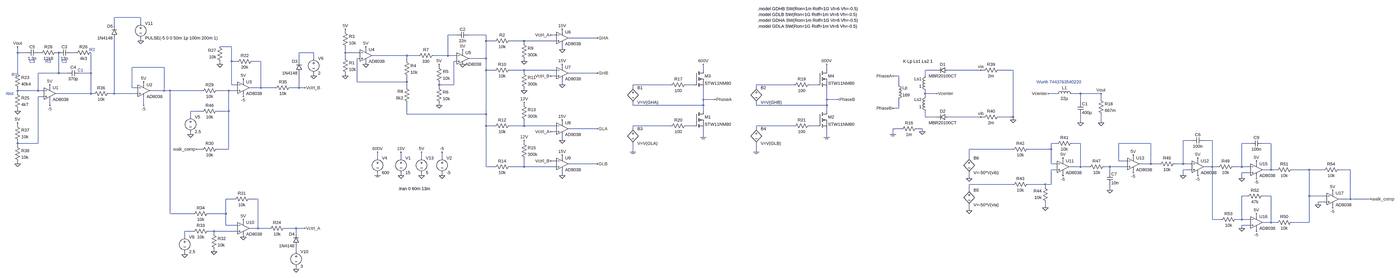
[diagram p0: schematic Full_Bridge_Converter.asc, whole sheet]
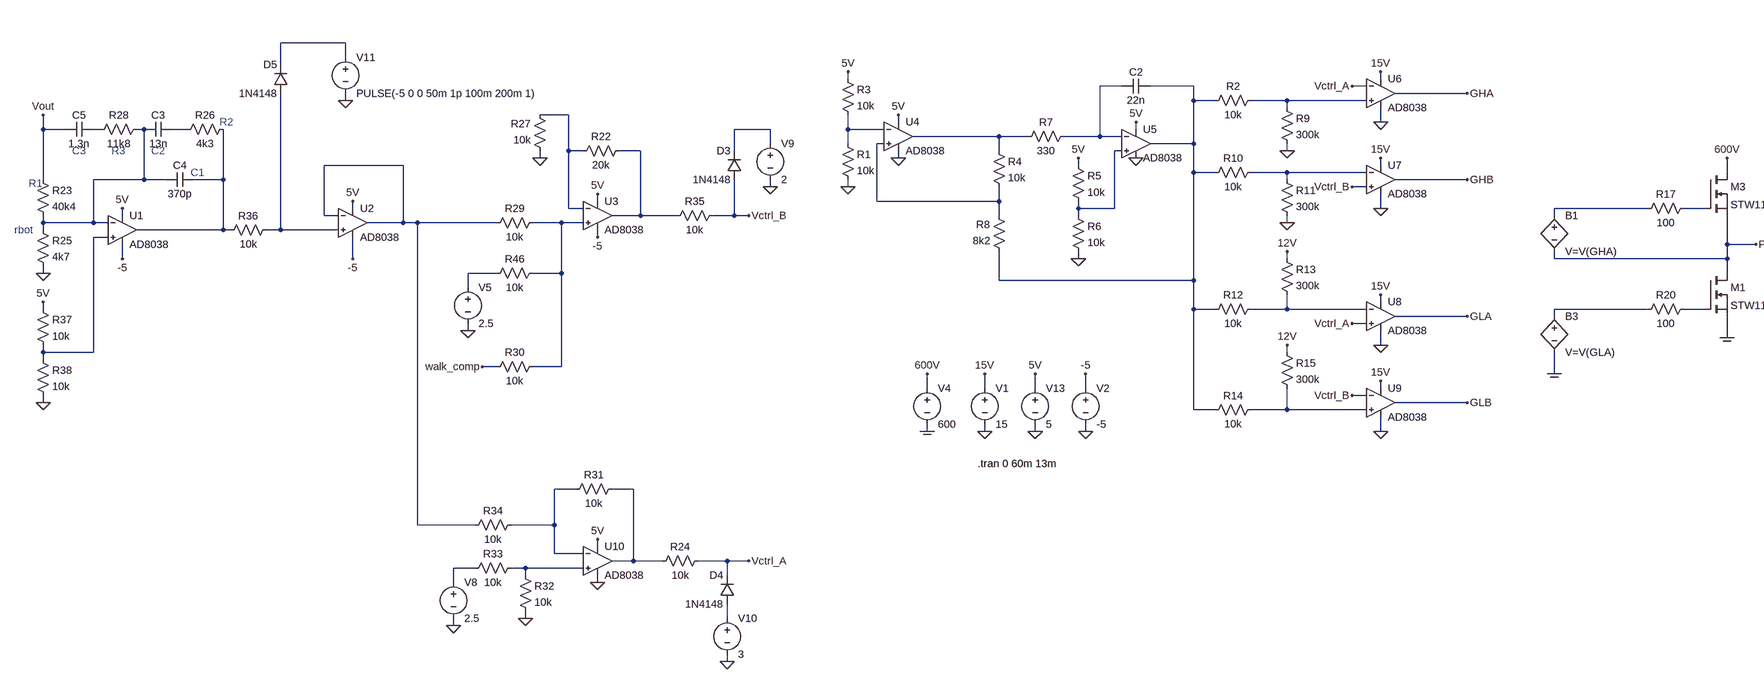
[diagram p1: schematic Full_Bridge_Converter.asc, part, row 1 of 1, column 1 of 2]
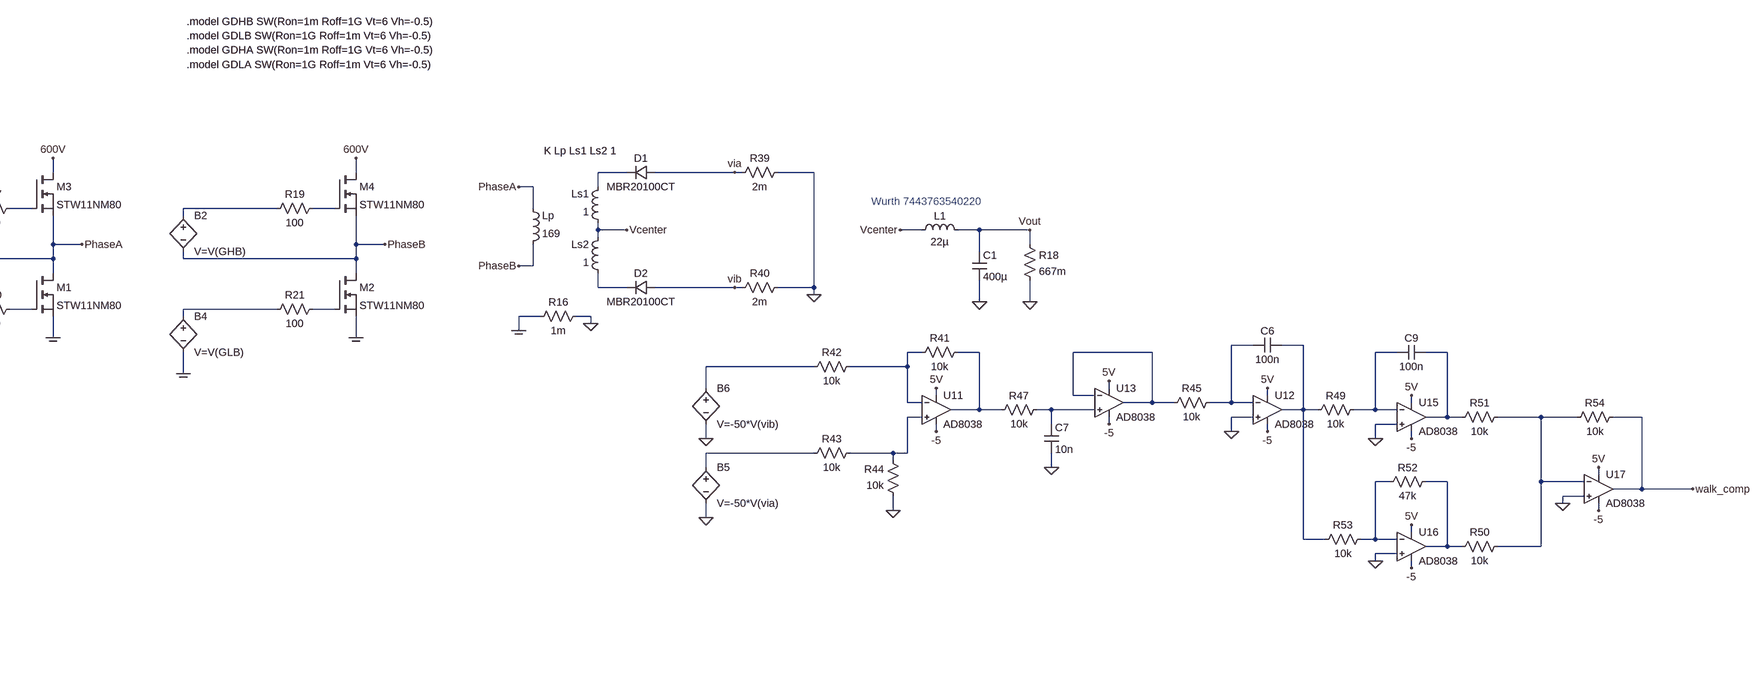
[diagram p2: schematic Full_Bridge_Converter.asc, part, row 1 of 1, column 2 of 2]
Full_Bridge_Converter.asc, the LTspice schematic file:
Version 4.1
SHEET 1 7284 996
WIRE -208 -400 -352 -400
WIRE -208 -368 -208 -400
WIRE -352 -352 -352 -400
WIRE 1072 -320 1072 -336
WIRE 2256 -320 2256 -336
WIRE 1680 -304 1632 -304
WIRE 1840 -304 1744 -304
WIRE 2224 -304 2192 -304
WIRE 2448 -288 2288 -288
WIRE -208 -272 -208 -288
WIRE 1840 -272 1840 -304
WIRE 1888 -272 1840 -272
WIRE 2048 -272 1968 -272
WIRE 2224 -272 2048 -272
WIRE 2048 -256 2048 -272
WIRE 288 -240 224 -240
WIRE 1184 -224 1184 -240
WIRE 2256 -224 2256 -256
WIRE -880 -208 -880 -240
WIRE -832 -208 -880 -208
WIRE -752 -208 -768 -208
WIRE -656 -208 -672 -208
WIRE -560 -208 -592 -208
WIRE 736 -208 656 -208
WIRE 1072 -208 1072 -240
WIRE 1152 -208 1072 -208
WIRE 1712 -208 1712 -224
WIRE 1408 -192 1216 -192
WIRE 1472 -192 1408 -192
WIRE 1632 -192 1632 -304
WIRE 1632 -192 1552 -192
WIRE 1680 -192 1632 -192
WIRE 736 -176 736 -208
WIRE 1072 -176 1072 -208
WIRE 1152 -176 1136 -176
WIRE 1840 -176 1840 -272
WIRE 1840 -176 1744 -176
WIRE 288 -160 288 -240
WIRE 320 -160 288 -160
WIRE 448 -160 400 -160
WIRE 656 -160 656 -208
WIRE 1408 -160 1408 -192
WIRE 1680 -160 1664 -160
WIRE 2048 -160 2048 -176
WIRE 224 -144 224 -160
WIRE 1184 -144 1184 -160
WIRE -80 -128 -256 -128
WIRE 1584 -128 1584 -144
WIRE 2256 -128 2256 -144
WIRE 1840 -112 1840 -176
WIRE 1888 -112 1840 -112
WIRE 2048 -112 1968 -112
WIRE 2224 -112 2048 -112
WIRE 3184 -112 3184 -144
WIRE 3984 -112 3984 -144
WIRE 4704 -112 4640 -112
WIRE 4944 -112 4768 -112
WIRE 4960 -112 4944 -112
WIRE 5120 -112 5040 -112
WIRE -880 -96 -880 -208
WIRE -656 -96 -656 -208
WIRE -656 -96 -768 -96
WIRE -608 -96 -656 -96
WIRE -480 -96 -480 -208
WIRE -480 -96 -544 -96
WIRE 2048 -96 2048 -112
WIRE 2448 -96 2288 -96
WIRE 736 -80 736 -96
WIRE 1072 -80 1072 -96
WIRE 2224 -80 2192 -80
WIRE 4496 -80 4464 -80
WIRE 4640 -80 4640 -112
WIRE 352 -48 352 -64
WIRE 1136 -48 1136 -176
WIRE 1408 -48 1408 -80
WIRE 1408 -48 1136 -48
WIRE -192 -32 -192 -48
WIRE 288 -32 288 -160
WIRE 320 -32 288 -32
WIRE 1584 -32 1584 -48
WIRE 1664 -32 1664 -160
WIRE 1664 -32 1584 -32
WIRE 2256 -32 2256 -64
WIRE 3008 -32 2800 -32
WIRE 3136 -32 3088 -32
WIRE 3808 -32 3600 -32
WIRE 3936 -32 3888 -32
WIRE 4496 -32 4496 -80
WIRE -704 -16 -704 -32
WIRE -256 -16 -256 -128
WIRE -224 -16 -256 -16
WIRE 448 -16 448 -160
WIRE 448 -16 384 -16
WIRE 528 -16 448 -16
WIRE 656 -16 656 -96
WIRE 656 -16 608 -16
WIRE 688 -16 656 -16
WIRE 1408 -16 1408 -48
WIRE 1584 -16 1584 -32
WIRE 2800 -16 2800 -32
WIRE 3600 -16 3600 -32
WIRE -880 0 -880 -16
WIRE -768 0 -768 -96
WIRE -768 0 -880 0
WIRE -736 0 -768 0
WIRE -80 0 -80 -128
WIRE -80 0 -160 0
WIRE -48 0 -80 0
WIRE 128 0 -48 0
WIRE 272 0 208 0
WIRE 320 0 272 0
WIRE 2048 0 2048 -16
WIRE -880 16 -880 0
WIRE -480 16 -480 -96
WIRE -480 16 -672 16
WIRE -464 16 -480 16
WIRE -352 16 -352 -288
WIRE -352 16 -384 16
WIRE -224 16 -352 16
WIRE 4640 16 4640 0
WIRE 4704 16 4640 16
WIRE 5360 16 5312 16
WIRE 5488 16 5440 16
WIRE 5600 16 5488 16
WIRE -736 32 -768 32
WIRE 352 32 352 16
WIRE 4640 32 4640 16
WIRE 3184 48 3184 -16
WIRE 3248 48 3184 48
WIRE 3984 48 3984 -16
WIRE 4048 48 3984 48
WIRE 5600 48 5600 16
WIRE 5488 64 5488 16
WIRE -704 80 -704 48
WIRE -192 80 -192 32
WIRE 1584 80 1584 64
WIRE 2048 80 2048 64
WIRE 2800 80 2800 64
WIRE 3184 80 3184 48
WIRE 3184 80 2800 80
WIRE 3600 80 3600 64
WIRE 3984 80 3984 48
WIRE 3984 80 3600 80
WIRE 4496 96 4496 48
WIRE 4496 96 4464 96
WIRE -880 112 -880 96
WIRE 128 112 64 112
WIRE 272 112 272 0
WIRE 272 112 208 112
WIRE 3184 112 3184 80
WIRE 3984 112 3984 80
WIRE 1408 128 1408 64
WIRE 1840 128 1840 -112
WIRE 1840 128 1408 128
WIRE 64 144 64 112
WIRE 4640 144 4640 112
WIRE 4704 144 4640 144
WIRE 4944 144 4768 144
WIRE 4960 144 4944 144
WIRE 5120 144 5120 -112
WIRE 5120 144 5040 144
WIRE 5120 160 5120 144
WIRE 2256 176 2256 160
WIRE 5488 176 5488 128
WIRE 5600 176 5600 128
WIRE -880 192 -880 176
WIRE 1840 192 1840 128
WIRE 1888 192 1840 192
WIRE 2048 192 2048 160
WIRE 2048 192 1968 192
WIRE 2224 192 2048 192
WIRE 3008 192 2800 192
WIRE 3136 192 3088 192
WIRE 3808 192 3600 192
WIRE 3936 192 3888 192
WIRE 2448 208 2288 208
WIRE 2800 208 2800 192
WIRE 3600 208 3600 192
WIRE 4512 208 4464 208
WIRE 4624 208 4592 208
WIRE 2224 224 2192 224
WIRE 4624 224 4624 208
WIRE 64 240 64 224
WIRE 4464 240 4464 208
WIRE 3184 256 3184 208
WIRE 3984 256 3984 208
WIRE 2256 272 2256 240
WIRE 6096 272 6048 272
WIRE 6208 272 6160 272
WIRE -880 288 -880 272
WIRE -768 288 -768 32
WIRE -768 288 -880 288
WIRE 2048 288 2048 272
WIRE 5360 288 5328 288
WIRE 5488 288 5440 288
WIRE 5872 288 5696 288
WIRE 6416 288 6368 288
WIRE 6528 288 6480 288
WIRE -880 304 -880 288
WIRE 128 320 96 320
WIRE 272 320 272 112
WIRE 272 320 208 320
WIRE 5120 320 4880 320
WIRE 5328 320 5328 288
WIRE 5328 320 5200 320
WIRE 2800 336 2800 288
WIRE 3600 336 3600 288
WIRE 1248 368 1248 336
WIRE 1376 368 1376 336
WIRE 1488 368 1488 336
WIRE 1600 368 1600 336
WIRE 2256 368 2256 352
WIRE 4880 368 4880 320
WIRE 5776 368 5776 352
WIRE 2224 384 2192 384
WIRE 5392 384 5392 368
WIRE 5696 384 5696 288
WIRE 5744 384 5696 384
WIRE 6128 384 6128 368
WIRE -880 400 -880 384
WIRE 2448 400 2288 400
WIRE 5328 400 5328 320
WIRE 5360 400 5328 400
WIRE 5872 400 5872 288
WIRE 5872 400 5808 400
WIRE 5920 400 5872 400
WIRE 6048 400 6048 272
WIRE 6048 400 6000 400
WIRE 6096 400 6048 400
WIRE 6448 400 6448 384
WIRE 1840 416 1840 192
WIRE 1888 416 1840 416
WIRE 2048 416 2048 368
WIRE 2048 416 1968 416
WIRE 2224 416 2048 416
WIRE 5488 416 5488 288
WIRE 5488 416 5424 416
WIRE 5536 416 5488 416
WIRE 5648 416 5616 416
WIRE 5744 416 5648 416
WIRE 6208 416 6208 272
WIRE 6208 416 6160 416
WIRE 6240 416 6208 416
WIRE 6368 416 6368 288
WIRE 6368 416 6320 416
WIRE 6416 416 6368 416
WIRE 5360 432 5328 432
WIRE 6096 432 6048 432
WIRE 6528 432 6528 288
WIRE 6528 432 6480 432
WIRE 6560 432 6528 432
WIRE 6736 432 6640 432
WIRE 6816 432 6736 432
WIRE 6960 432 6896 432
WIRE 5648 448 5648 416
WIRE 5776 448 5776 432
WIRE 6416 448 6368 448
WIRE 1248 464 1248 448
WIRE 1376 464 1376 448
WIRE 1488 464 1488 448
WIRE 1600 464 1600 448
WIRE 2256 464 2256 432
WIRE 5392 464 5392 448
WIRE 6048 464 6048 432
WIRE 6128 464 6128 448
WIRE 4880 480 4880 448
WIRE 6368 480 6368 448
WIRE 6448 480 6448 464
WIRE 5120 512 4880 512
WIRE 5296 512 5200 512
WIRE 5328 512 5328 432
WIRE 5328 512 5296 512
WIRE 5296 528 5296 512
WIRE 4880 544 4880 512
WIRE 5648 544 5648 512
WIRE 6864 560 6864 544
WIRE 6400 576 6368 576
WIRE 6528 576 6480 576
WIRE 6736 576 6736 432
WIRE 6832 576 6736 576
WIRE 304 592 256 592
WIRE 432 592 384 592
WIRE 6960 592 6960 432
WIRE 6960 592 6896 592
WIRE 7088 592 6960 592
WIRE 6832 608 6784 608
WIRE 6784 624 6784 608
WIRE 5296 640 5296 608
WIRE 6864 640 6864 624
WIRE 4880 656 4880 624
WIRE -48 672 -48 0
WIRE 80 672 -48 672
WIRE 256 672 256 592
WIRE 256 672 160 672
WIRE 6448 688 6448 672
WIRE 6208 704 6208 416
WIRE 6256 704 6208 704
WIRE 6368 704 6368 576
WIRE 6368 704 6336 704
WIRE 6416 704 6368 704
WIRE 352 720 352 704
WIRE 6528 720 6528 576
WIRE 6528 720 6480 720
WIRE 6560 720 6528 720
WIRE 6736 720 6736 576
WIRE 6736 720 6640 720
WIRE 256 736 256 672
WIRE 320 736 256 736
WIRE 6416 736 6368 736
WIRE 432 752 432 592
WIRE 432 752 384 752
WIRE 496 752 432 752
WIRE 640 752 576 752
WIRE 688 752 640 752
WIRE 6368 752 6368 736
WIRE 80 768 32 768
WIRE 192 768 160 768
WIRE 320 768 192 768
WIRE 6448 768 6448 752
WIRE 192 784 192 768
WIRE 640 784 640 752
WIRE 32 800 32 768
WIRE 352 800 352 784
WIRE 192 880 192 864
WIRE 640 880 640 848
WIRE 32 896 32 880
WIRE 640 976 640 960
FLAG 1376 464 0
FLAG 1376 336 15V
FLAG 1184 -144 0
FLAG 1072 -80 0
FLAG 1584 80 0
FLAG 1712 -144 0
FLAG 2256 -224 0
FLAG 2256 -32 0
FLAG 2192 -304 Vctrl_A
FLAG 2192 -80 Vctrl_B
FLAG 2448 -288 GHA
FLAG 2448 -96 GHB
FLAG 2256 272 0
FLAG 2256 464 0
FLAG 2192 224 Vctrl_A
FLAG 2192 384 Vctrl_B
FLAG 2448 208 GLA
FLAG 2448 400 GLB
FLAG 2048 -160 0
FLAG 2048 0 0
FLAG 2048 64 12V
FLAG 2048 272 12V
FLAG 1248 336 600V
FLAG 3184 -144 600V
FLAG 3984 -144 600V
FLAG 4048 48 PhaseB
FLAG 3248 48 PhaseA
FLAG 4464 96 PhaseB
FLAG 4464 -80 PhaseA
FLAG -880 112 0
FLAG 5600 16 Vout
FLAG -880 -240 Vout
FLAG 4624 224 0
FLAG 5488 176 0
FLAG 5600 176 0
FLAG 4464 240 COM
FLAG 3984 256 COM
FLAG 3600 336 COM
FLAG 3184 256 COM
FLAG 2800 336 COM
FLAG 1248 464 COM
FLAG 224 -144 0
FLAG 64 240 0
FLAG 352 800 0
FLAG 192 880 0
FLAG 32 896 0
FLAG 688 -16 Vctrl_B
FLAG 688 752 Vctrl_A
FLAG 640 976 0
FLAG 736 -80 0
FLAG -208 -272 0
FLAG 1488 464 0
FLAG 1488 336 5V
FLAG 1072 -336 5V
FLAG 1184 -240 5V
FLAG 1584 -144 5V
FLAG 1712 -224 5V
FLAG 1600 464 0
FLAG 1600 336 -5
FLAG -192 -48 5V
FLAG -704 80 -5
FLAG -192 80 -5
FLAG -704 -32 5V
FLAG -880 400 0
FLAG -880 176 5V
FLAG 352 -64 5V
FLAG 352 704 5V
FLAG 2256 -336 15V
FLAG 2256 -144 15V
FLAG 2256 160 15V
FLAG 2256 352 15V
FLAG 5120 160 0
FLAG 5312 16 Vcenter
FLAG 4704 16 Vcenter
FLAG 4880 656 0
FLAG 4880 480 0
FLAG 4944 -112 via
FLAG 4944 144 vib
FLAG 5392 368 5V
FLAG 5392 464 -5
FLAG 5296 640 0
FLAG 96 320 walk_comp
FLAG 352 32 -5
FLAG 6128 368 5V
FLAG 6128 464 -5
FLAG 6048 464 0
FLAG 5648 544 0
FLAG 5776 352 5V
FLAG 5776 448 -5
FLAG 6448 384 5V
FLAG 6448 480 -5
FLAG 6368 480 0
FLAG 7088 592 walk_comp
FLAG 6448 672 5V
FLAG 6448 768 -5
FLAG 6864 544 5V
FLAG 6864 640 -5
FLAG 6784 624 0
FLAG 6368 752 0
SYMBOL voltage 1376 352 R0
WINDOW 123 0 0 Left 0
WINDOW 39 0 0 Left 0
SYMATTR InstName V1
SYMATTR Value 15
SYMBOL res 1056 -192 R0
SYMATTR InstName R1
SYMATTR Value 10k
SYMBOL res 1056 -336 R0
SYMATTR InstName R3
SYMATTR Value 10k
SYMBOL res 1392 -176 R0
SYMATTR InstName R4
SYMATTR Value 10k
SYMBOL OpAmps\\AD8038 1184 -256 R0
SYMATTR InstName U4
SYMBOL OpAmps\\AD8038 1712 -240 R0
SYMATTR InstName U5
SYMBOL res 1568 -144 R0
SYMATTR InstName R5
SYMATTR Value 10k
SYMBOL res 1568 -32 R0
SYMATTR InstName R6
SYMATTR Value 10k
SYMBOL res 1568 -208 R90
WINDOW 0 0 56 VBottom 2
WINDOW 3 32 56 VTop 2
SYMATTR InstName R7
SYMATTR Value 330
SYMBOL res 1424 80 R180
WINDOW 0 36 76 Left 2
WINDOW 3 36 40 Left 2
SYMATTR InstName R8
SYMATTR Value 8k2
SYMBOL cap 1744 -320 R90
WINDOW 0 0 32 VBottom 2
WINDOW 3 32 32 VTop 2
SYMATTR InstName C2
SYMATTR Value 22n
SYMBOL OpAmps\\AD8038 2256 -352 R0
SYMATTR InstName U6
SYMBOL OpAmps\\AD8038 2256 -160 R0
SYMATTR InstName U7
SYMBOL OpAmps\\AD8038 2256 144 R0
SYMATTR InstName U8
SYMBOL OpAmps\\AD8038 2256 336 R0
SYMATTR InstName U9
SYMBOL res 1984 -288 R90
WINDOW 0 0 56 VBottom 2
WINDOW 3 32 56 VTop 2
SYMATTR InstName R2
SYMATTR Value 10k
SYMBOL res 2032 -272 R0
SYMATTR InstName R9
SYMATTR Value 300k
SYMBOL res 1984 -128 R90
WINDOW 0 0 56 VBottom 2
WINDOW 3 32 56 VTop 2
SYMATTR InstName R10
SYMATTR Value 10k
SYMBOL res 2032 -112 R0
SYMATTR InstName R11
SYMATTR Value 300k
SYMBOL res 1984 176 R90
WINDOW 0 0 56 VBottom 2
WINDOW 3 32 56 VTop 2
SYMATTR InstName R12
SYMATTR Value 10k
SYMBOL res 1984 400 R90
WINDOW 0 0 56 VBottom 2
WINDOW 3 32 56 VTop 2
SYMATTR InstName R14
SYMATTR Value 10k
SYMBOL res 2032 64 R0
SYMATTR InstName R13
SYMATTR Value 300k
SYMBOL res 2032 272 R0
SYMATTR InstName R15
SYMATTR Value 300k
SYMBOL nmos 3136 112 R0
SYMATTR InstName M1
SYMATTR Value STW11NM80
SYMBOL voltage 1248 352 R0
WINDOW 123 0 0 Left 0
WINDOW 39 0 0 Left 0
SYMATTR InstName V4
SYMATTR Value 600
SYMBOL res 3104 -48 R90
WINDOW 0 0 56 VBottom 2
WINDOW 3 32 56 VTop 2
SYMATTR InstName R17
SYMATTR Value 100
SYMBOL res 3904 -48 R90
WINDOW 0 0 56 VBottom 2
WINDOW 3 32 56 VTop 2
SYMATTR InstName R19
SYMATTR Value 100
SYMBOL nmos 3936 112 R0
SYMATTR InstName M2
SYMATTR Value STW11NM80
SYMBOL nmos 3136 -112 R0
SYMATTR InstName M3
SYMATTR Value STW11NM80
SYMBOL nmos 3936 -112 R0
SYMATTR InstName M4
SYMATTR Value STW11NM80
SYMBOL bv 2800 -32 R0
SYMATTR InstName B1
SYMATTR Value V=V(GHA)
SYMBOL bv 3600 -32 R0
SYMATTR InstName B2
SYMATTR Value V=V(GHB)
SYMBOL ind 4480 64 M180
WINDOW 0 36 80 Left 2
WINDOW 3 36 40 Left 2
SYMATTR InstName Lp
SYMATTR Value 169
SYMATTR SpiceLine Rser=10m
SYMBOL ind 4656 16 R180
WINDOW 0 36 80 Left 2
WINDOW 3 36 40 Left 2
SYMATTR InstName Ls1
SYMATTR Value 1
SYMATTR SpiceLine Rser=10m
SYMBOL ind 4656 128 R180
WINDOW 0 36 80 Left 2
WINDOW 3 36 40 Left 2
SYMATTR InstName Ls2
SYMATTR Value 1
SYMATTR SpiceLine Rser=10m
SYMBOL res 4608 192 R90
WINDOW 0 0 56 VBottom 2
WINDOW 3 32 56 VTop 2
SYMATTR InstName R16
SYMATTR Value 1m
SYMBOL bv 2800 192 R0
SYMATTR InstName B3
SYMATTR Value V=V(GLA)
SYMBOL bv 3600 192 R0
SYMATTR InstName B4
SYMATTR Value V=V(GLB)
SYMBOL ind 5344 32 R270
WINDOW 0 32 56 VTop 2
WINDOW 3 5 56 VBottom 2
SYMATTR InstName L1
SYMATTR Value 22µ
SYMBOL cap 5472 64 R0
SYMATTR InstName C1
SYMATTR Value 400µ
SYMBOL res 5584 32 R0
SYMATTR InstName R18
SYMATTR Value 667m
SYMBOL diode 4768 -96 M270
WINDOW 0 32 32 VTop 2
WINDOW 3 0 32 VBottom 2
SYMATTR InstName D1
SYMATTR Value MBR20100CT
SYMBOL diode 4768 160 M270
WINDOW 0 32 32 VTop 2
WINDOW 3 0 32 VBottom 2
SYMATTR InstName D2
SYMATTR Value MBR20100CT
SYMBOL res 3104 176 R90
WINDOW 0 0 56 VBottom 2
WINDOW 3 32 56 VTop 2
SYMATTR InstName R20
SYMATTR Value 100
SYMBOL res 3904 176 R90
WINDOW 0 0 56 VBottom 2
WINDOW 3 32 56 VTop 2
SYMATTR InstName R21
SYMATTR Value 100
SYMBOL res -896 -112 R0
SYMATTR InstName R23
SYMATTR Value 40k4
SYMBOL res -896 0 R0
SYMATTR InstName R25
SYMATTR Value 4k7
SYMBOL cap -592 -224 R90
WINDOW 0 0 32 VBottom 2
WINDOW 3 32 32 VTop 2
SYMATTR InstName C3
SYMATTR Value 13n
SYMBOL cap -544 -112 R90
WINDOW 0 0 32 VBottom 2
WINDOW 3 32 32 VTop 2
SYMATTR InstName C4
SYMATTR Value 370p
SYMBOL res -464 -224 R90
WINDOW 0 0 56 VBottom 2
WINDOW 3 32 56 VTop 2
SYMATTR InstName R26
SYMATTR Value 4k3
SYMBOL OpAmps\\AD8038 -704 -48 R0
SYMATTR InstName U1
SYMBOL OpAmps\\AD8038 352 -80 R0
SYMATTR InstName U3
SYMBOL res 416 -176 R90
WINDOW 0 0 56 VBottom 2
WINDOW 3 32 56 VTop 2
SYMATTR InstName R22
SYMATTR Value 20k
SYMBOL res 240 -144 R180
WINDOW 0 36 76 Left 2
WINDOW 3 36 40 Left 2
SYMATTR InstName R27
SYMATTR Value 10k
SYMBOL res 224 -16 R90
WINDOW 0 0 56 VBottom 2
WINDOW 3 32 56 VTop 2
SYMATTR InstName R29
SYMATTR Value 10k
SYMBOL res 224 304 R90
WINDOW 0 0 56 VBottom 2
WINDOW 3 32 56 VTop 2
SYMATTR InstName R30
SYMATTR Value 10k
SYMBOL voltage 64 128 R0
WINDOW 123 0 0 Left 0
WINDOW 39 0 0 Left 0
SYMATTR InstName V5
SYMATTR Value 2.5
SYMBOL OpAmps\\AD8038 352 688 R0
SYMATTR InstName U10
SYMBOL res 400 576 R90
WINDOW 0 0 56 VBottom 2
WINDOW 3 32 56 VTop 2
SYMATTR InstName R31
SYMATTR Value 10k
SYMBOL res 176 768 R0
SYMATTR InstName R32
SYMATTR Value 10k
SYMBOL res 176 752 R90
WINDOW 0 0 56 VBottom 2
WINDOW 3 32 56 VTop 2
SYMATTR InstName R33
SYMATTR Value 10k
SYMBOL res 176 656 R90
WINDOW 0 0 56 VBottom 2
WINDOW 3 32 56 VTop 2
SYMATTR InstName R34
SYMATTR Value 10k
SYMBOL voltage 32 784 R0
WINDOW 123 0 0 Left 0
WINDOW 39 0 0 Left 0
SYMATTR InstName V8
SYMATTR Value 2.5
SYMBOL diode 656 848 R180
WINDOW 0 24 64 Left 2
WINDOW 3 24 0 Left 2
SYMATTR InstName D4
SYMATTR Value 1N4148
SYMBOL voltage 640 864 R0
WINDOW 123 0 0 Left 0
WINDOW 39 0 0 Left 0
SYMATTR InstName V10
SYMATTR Value 3
SYMBOL res 592 736 R90
WINDOW 0 0 56 VBottom 2
WINDOW 3 32 56 VTop 2
SYMATTR InstName R24
SYMATTR Value 10k
SYMBOL res 624 -32 R90
WINDOW 0 0 56 VBottom 2
WINDOW 3 32 56 VTop 2
SYMATTR InstName R35
SYMATTR Value 10k
SYMBOL diode 672 -96 R180
WINDOW 0 24 64 Left 2
WINDOW 3 24 0 Left 2
SYMATTR InstName D3
SYMATTR Value 1N4148
SYMBOL voltage 736 -192 R0
WINDOW 123 0 0 Left 0
WINDOW 39 0 0 Left 0
SYMATTR InstName V9
SYMATTR Value 2
SYMBOL diode -336 -288 R180
WINDOW 0 24 64 Left 2
WINDOW 3 24 0 Left 2
SYMATTR InstName D5
SYMATTR Value 1N4148
SYMBOL voltage -208 -384 R0
WINDOW 123 0 0 Left 0
WINDOW 39 0 0 Left 0
SYMATTR InstName V11
SYMATTR Value PULSE(-5 0 0 50m 1p 100m 200m 1)
SYMBOL res -368 0 R90
WINDOW 0 0 56 VBottom 2
WINDOW 3 32 56 VTop 2
SYMATTR InstName R36
SYMATTR Value 10k
SYMBOL OpAmps\\AD8038 -192 -64 R0
SYMATTR InstName U2
SYMBOL res -656 -224 R90
WINDOW 0 0 56 VBottom 2
WINDOW 3 32 56 VTop 2
SYMATTR InstName R28
SYMATTR Value 11k8
SYMBOL cap -768 -224 R90
WINDOW 0 0 32 VBottom 2
WINDOW 3 32 32 VTop 2
SYMATTR InstName C5
SYMATTR Value 1.3n
SYMBOL voltage 1488 352 R0
WINDOW 123 0 0 Left 0
WINDOW 39 0 0 Left 0
SYMATTR InstName V13
SYMATTR Value 5
SYMBOL voltage 1600 352 R0
WINDOW 123 0 0 Left 0
WINDOW 39 0 0 Left 0
SYMATTR InstName V2
SYMATTR Value -5
SYMBOL res -896 176 R0
SYMATTR InstName R37
SYMATTR Value 10k
SYMBOL res -896 288 R0
SYMATTR InstName R38
SYMATTR Value 10k
SYMBOL res 5056 -128 R90
WINDOW 0 0 56 VBottom 2
WINDOW 3 32 56 VTop 2
SYMATTR InstName R39
SYMATTR Value 2m
SYMBOL res 5056 128 R90
WINDOW 0 0 56 VBottom 2
WINDOW 3 32 56 VTop 2
SYMATTR InstName R40
SYMATTR Value 2m
SYMBOL bv 4880 528 R0
SYMATTR InstName B5
SYMATTR Value V=-50*V(via)
SYMBOL bv 4880 352 R0
SYMATTR InstName B6
SYMATTR Value V=-50*V(vib)
SYMBOL OpAmps\\AD8038 5392 352 R0
SYMATTR InstName U11
SYMBOL res 5456 272 R90
WINDOW 0 0 56 VBottom 2
WINDOW 3 32 56 VTop 2
SYMATTR InstName R41
SYMATTR Value 10k
SYMBOL res 5216 304 R90
WINDOW 0 0 56 VBottom 2
WINDOW 3 32 56 VTop 2
SYMATTR InstName R42
SYMATTR Value 10k
SYMBOL res 5216 496 R90
WINDOW 0 0 56 VBottom 2
WINDOW 3 32 56 VTop 2
SYMATTR InstName R43
SYMATTR Value 10k
SYMBOL res 5312 624 R180
WINDOW 0 36 76 Left 2
WINDOW 3 36 40 Left 2
SYMATTR InstName R44
SYMATTR Value 10k
SYMBOL res 224 96 R90
WINDOW 0 0 56 VBottom 2
WINDOW 3 32 56 VTop 2
SYMATTR InstName R46
SYMATTR Value 10k
SYMBOL OpAmps\\AD8038 6128 352 R0
SYMATTR InstName U12
SYMBOL cap 6160 256 R90
WINDOW 0 0 32 VBottom 2
WINDOW 3 32 32 VTop 2
SYMATTR InstName C6
SYMATTR Value 100n
SYMBOL res 6016 384 R90
WINDOW 0 0 56 VBottom 2
WINDOW 3 32 56 VTop 2
SYMATTR InstName R45
SYMATTR Value 10k
SYMBOL res 5632 400 R90
WINDOW 0 0 56 VBottom 2
WINDOW 3 32 56 VTop 2
SYMATTR InstName R47
SYMATTR Value 10k
SYMBOL cap 5632 448 R0
SYMATTR InstName C7
SYMATTR Value 10n
SYMBOL OpAmps\\AD8038 5776 336 R0
SYMATTR InstName U13
SYMBOL OpAmps\\AD8038 6448 368 R0
SYMATTR InstName U15
SYMBOL cap 6480 272 R90
WINDOW 0 0 32 VBottom 2
WINDOW 3 32 32 VTop 2
SYMATTR InstName C9
SYMATTR Value 100n
SYMBOL res 6336 400 R90
WINDOW 0 0 56 VBottom 2
WINDOW 3 32 56 VTop 2
SYMATTR InstName R49
SYMATTR Value 10k
SYMBOL OpAmps\\AD8038 6448 656 R0
SYMATTR InstName U16
SYMBOL res 6656 704 R90
WINDOW 0 0 56 VBottom 2
WINDOW 3 32 56 VTop 2
SYMATTR InstName R50
SYMATTR Value 10k
SYMBOL res 6656 416 R90
WINDOW 0 0 56 VBottom 2
WINDOW 3 32 56 VTop 2
SYMATTR InstName R51
SYMATTR Value 10k
SYMBOL res 6496 560 R90
WINDOW 0 0 56 VBottom 2
WINDOW 3 32 56 VTop 2
SYMATTR InstName R52
SYMATTR Value 47k
SYMBOL res 6352 688 R90
WINDOW 0 0 56 VBottom 2
WINDOW 3 32 56 VTop 2
SYMATTR InstName R53
SYMATTR Value 10k
SYMBOL OpAmps\\AD8038 6864 528 R0
SYMATTR InstName U17
SYMBOL res 6912 416 R90
WINDOW 0 0 56 VBottom 2
WINDOW 3 32 56 VTop 2
SYMATTR InstName R54
SYMATTR Value 10k
TEXT 1360 536 Left 2 !.tran 0 60m 13m
TEXT 3608 -384 Left 2 !.model GDHA SW(Ron=1m Roff=1G Vt=6 Vh=-0.5)
TEXT 3608 -352 Left 2 !.model GDLA SW(Ron=1G Roff=1m Vt=6 Vh=-0.5)
TEXT 3608 -448 Left 2 !.model GDHB SW(Ron=1m Roff=1G Vt=6 Vh=-0.5)
TEXT 3608 -416 Left 2 !.model GDLB SW(Ron=1G Roff=1m Vt=6 Vh=-0.5)
TEXT 4520 -160 Left 2 !K Lp Ls1 Ls2 1
TEXT -552 -112 Left 2 ;C1
TEXT -640 -160 Left 2 ;C2
TEXT -728 -160 Left 2 ;R3
TEXT -816 -160 Left 2 ;C3
TEXT -488 -224 Left 2 ;R2
TEXT -912 -88 Left 2 ;R1
TEXT -944 16 Left 2 ;rbot
TEXT 5248 -48 Left 2 ;Wurth 7443763540220

The netlist it stands for:
* Full_Bridge_Converter.asc
V1 15V 0 15
R1 N010 0 10k
R3 5V N010 10k
R4 N011 N012 10k
X§U4 N012 N010 5V 0 N011 AD8038  ; pins In+ In- V+ V- OUT
X§U5 N014 N002 5V 0 N003 AD8038  ; pins In+ In- V+ V- OUT
R5 5V N014 10k
R6 N014 0 10k
R7 N002 N011 330
R8 N003 N012 8k2
C2 N003 N002 22n
X§U6 N004 Vctrl_A 15V 0 GHA AD8038  ; pins In+ In- V+ V- OUT
X§U7 Vctrl_B N016 15V 0 GHB AD8038  ; pins In+ In- V+ V- OUT
X§U8 Vctrl_A N028 15V 0 GLA AD8038  ; pins In+ In- V+ V- OUT
X§U9 N041 Vctrl_B 15V 0 GLB AD8038  ; pins In+ In- V+ V- OUT
R2 N004 N003 10k
R9 N004 0 300k
R10 N016 N003 10k
R11 N016 0 300k
R12 N028 N003 10k
R14 N041 N003 10k
R13 12V N028 300k
R15 12V N041 300k
M1 PhaseA N030 COM COM STW11NM80
V4 600V COM 600
R17 N020 N019 100
R19 N022 N021 100
M2 PhaseB N032 COM COM STW11NM80
M3 600V N020 PhaseA PhaseA STW11NM80
M4 600V N022 PhaseB PhaseB STW11NM80
B1 N019 PhaseA V=V(GHA)
B2 N021 PhaseB V=V(GHB)
Lp PhaseB PhaseA 169 Rser=10m
Ls1 Vcenter N017 1 Rser=10m
Ls2 N027 Vcenter 1 Rser=10m
R16 0 COM 1m
B3 N029 COM V=V(GLA)
B4 N031 COM V=V(GLB)
L1 Vcenter Vout 22µ
C1 Vout 0 400µ
R18 Vout 0 667m
D1 via N017 MBR20100CT
D2 vib N027 MBR20100CT
R20 N030 N029 100
R21 N032 N031 100
R23 Vout N007 40k4
R25 N007 0 4k7
C3 N008 N007 13n
C4 N018 N007 370p
R26 N018 N008 4k3
X§U1 N025 N007 5V -5 N018 AD8038  ; pins In+ In- V+ V- OUT
X§U3 N023 N005 5V -5 N013 AD8038  ; pins In+ In- V+ V- OUT
R22 N013 N005 20k
R27 0 N005 10k
R29 N023 N015 10k
R30 N023 walk_comp 10k
V5 N026 0 2.5
X§U10 N051 N048 5V 0 N049 AD8038  ; pins In+ In- V+ V- OUT
R31 N049 N048 10k
R32 N051 0 10k
R33 N051 N050 10k
R34 N048 N015 10k
V8 N050 0 2.5
D4 N052 Vctrl_A 1N4148
V10 N052 0 3
R24 Vctrl_A N049 10k
R35 Vctrl_B N013 10k
D3 Vctrl_B N009 1N4148
V9 N009 0 2
D5 N024 N001 1N4148
V11 N001 0 PULSE(-5 0 0 50m 1p 100m 200m 1)
R36 N024 N018 10k
X§U2 N024 N015 5V -5 N015 AD8038  ; pins In+ In- V+ V- OUT
R28 N007 N006 11k8
C5 N006 Vout 1.3n
V13 5V 0 5
V2 -5 0 -5
R37 5V N025 10k
R38 N025 0 10k
R39 0 via 2m
R40 0 vib 2m
B5 N045 0 V=-50*V(via)
B6 N040 0 V=-50*V(vib)
X§U11 N043 N035 5V -5 N036 AD8038  ; pins In+ In- V+ V- OUT
R41 N036 N035 10k
R42 N035 N040 10k
R43 N043 N045 10k
R44 0 N043 10k
R46 N023 N026 10k
X§U12 0 N033 5V -5 N034 AD8038  ; pins In+ In- V+ V- OUT
C6 N034 N033 100n
R45 N033 N037 10k
R47 N042 N036 10k
C7 N042 0 10n
X§U13 N042 N037 5V -5 N037 AD8038  ; pins In+ In- V+ V- OUT
X§U15 0 N038 5V -5 N039 AD8038  ; pins In+ In- V+ V- OUT
C9 N039 N038 100n
R49 N038 N034 10k
X§U16 0 N046 5V -5 N047 AD8038  ; pins In+ In- V+ V- OUT
R50 N044 N047 10k
R51 N044 N039 10k
R52 N047 N046 47k
R53 N046 N034 10k
X§U17 0 N044 5V -5 walk_comp AD8038  ; pins In+ In- V+ V- OUT
R54 walk_comp N044 10k
.model D D
.lib standard.dio
.model NMOS NMOS
.model PMOS PMOS
.lib standard.mos
.tran 0 60m 13m
.model GDHA SW(Ron=1m Roff=1G Vt=6 Vh=-0.5)
.model GDLA SW(Ron=1G Roff=1m Vt=6 Vh=-0.5)
.model GDHB SW(Ron=1m Roff=1G Vt=6 Vh=-0.5)
.model GDLB SW(Ron=1G Roff=1m Vt=6 Vh=-0.5)
K Lp Ls1 Ls2 1
* C1
* C2
* R3
* C3
* R2
* R1
* rbot
* Wurth 7443763540220
.backanno
.end